# Altium schematic sheet Input_block.SchDoc
size A4
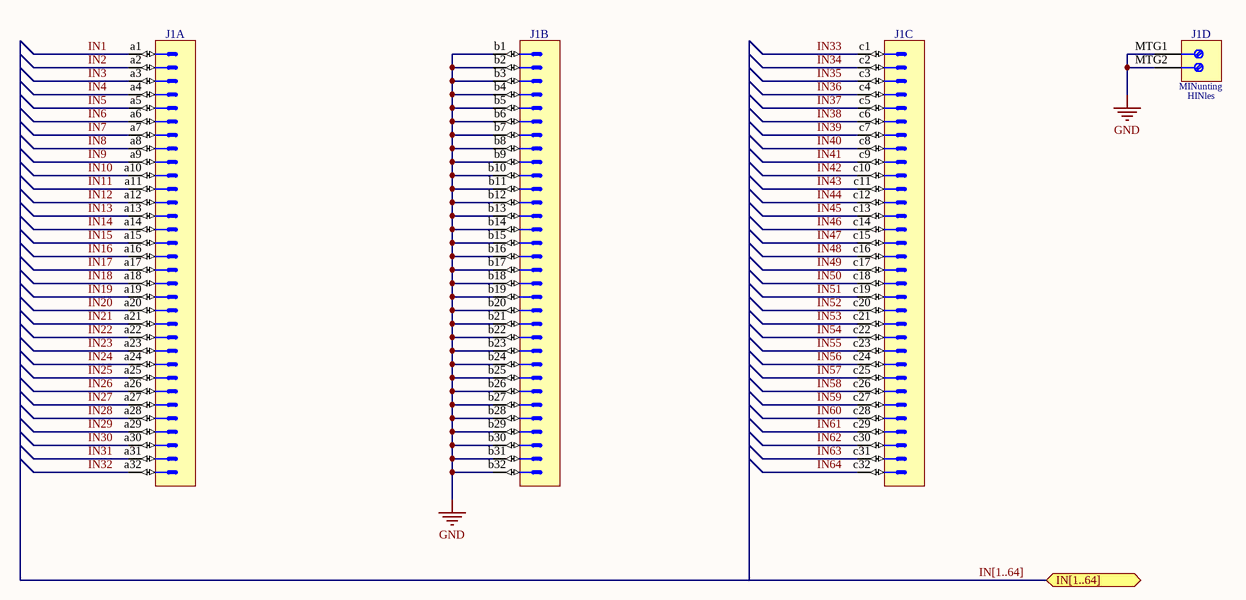
[diagram p0: Input_block.SchDoc]

## Parts
J1  DIN 41612 Type C  [HARTING_09 03 196 6921]  (value not drawn)  (parts A,B,C,D of 4)

## Ports
IN[1..64] (bidir)

## Nets
GND: J1.b1 J1.b2 J1.b3 J1.b4 J1.b5 J1.b6 J1.b7 J1.b8 J1.b9 J1.b10 J1.b11 J1.b12 J1.b13 J1.b14 J1.b15 J1.b16 J1.b17 J1.b18 J1.b19 J1.b20 J1.b21 J1.b22 J1.b23 J1.b24 J1.b25 J1.b26 J1.b27 J1.b28 J1.b29 J1.b30 J1.b31 J1.b32 J1.MTG1 J1.MTG2
IN1: J1.a1
IN2: J1.a2
IN3: J1.a3
IN4: J1.a4
IN5: J1.a5
IN6: J1.a6
IN7: J1.a7
IN8: J1.a8
IN9: J1.a9
IN10: J1.a10
IN11: J1.a11
IN12: J1.a12
IN13: J1.a13
IN14: J1.a14
IN15: J1.a15
IN16: J1.a16
IN17: J1.a17
IN18: J1.a18
IN19: J1.a19
IN20: J1.a20
IN21: J1.a21
IN22: J1.a22
IN23: J1.a23
IN24: J1.a24
IN25: J1.a25
IN26: J1.a26
IN27: J1.a27
IN28: J1.a28
IN29: J1.a29
IN30: J1.a30
IN31: J1.a31
IN32: J1.a32
IN33: J1.c1
IN34: J1.c2
IN35: J1.c3
IN36: J1.c4
IN37: J1.c5
IN38: J1.c6
IN39: J1.c7
IN40: J1.c8
IN41: J1.c9
IN42: J1.c10
IN43: J1.c11
IN44: J1.c12
IN45: J1.c13
IN46: J1.c14
IN47: J1.c15
IN48: J1.c16
IN49: J1.c17
IN50: J1.c18
IN51: J1.c19
IN52: J1.c20
IN53: J1.c21
IN54: J1.c22
IN55: J1.c23
IN56: J1.c24
IN57: J1.c25
IN58: J1.c26
IN59: J1.c27
IN60: J1.c28
IN61: J1.c29
IN62: J1.c30
IN63: J1.c31
IN64: J1.c32

## Buses and harness runs
bus IN[1..64] = port IN[1..64]

## Notes on the sheet
- (in symbol HARTING_09 03 196 6921, part D) MINunting; HINles

## Library data of the parts
J1 = HARTING_09 03 196 6921: Connector 96abc male (3x32); Part Description: DIN 41612, Type C, 96 Position, Rows a+b+c, Performance level 2, Right Angle Male Connector, Lead 3.0 mm, Pitch 2.54mm; PressFit: No; SCEM: 09.61.33.315.7; Part Number: HARTING_09 03 196 6921; Component Kind: Standard; Component Type: Standard; Pin Count: 98; Family: DIN 41612 Type C; Mounted: Yes; Socket: No; SMD: No; Sense: No; Status: None; Manufacturer: HARTING; Manufacturer Part Number: 09 03 196 6921; ComponentHeight: 11mm; HelpURL: \\cern.ch\dfs\Applications\Altium\Datasheets\HARTING_09 03 196 6921.pdf; Author: CERN DEM JMW; CreateDate: 25.02.2013; LatestRevisionDate: 25.02.2013